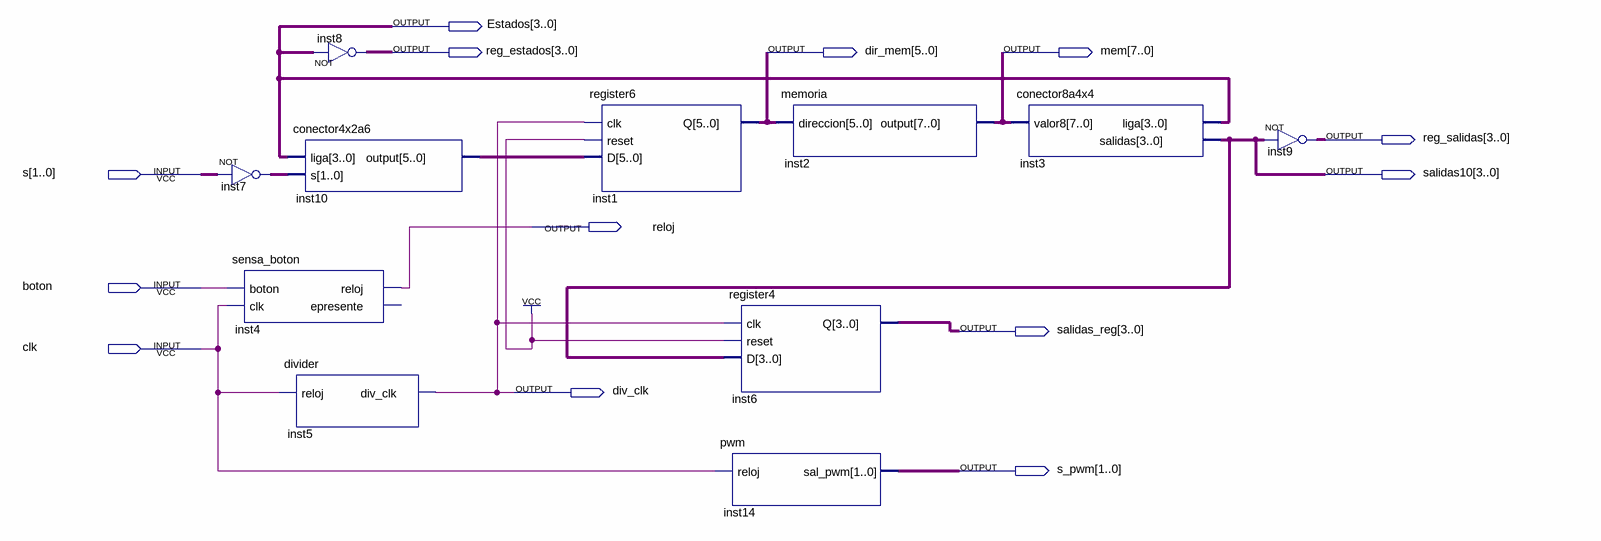
[diagram p0: schematic sheet]
// Quartus schematic practica3.bdf as structural Verilog: 11 symbols, 13 pins
module practica3 (
  input  [1:0] s,
  input  boton,
  input  clk,
  output [3:0] Estados,
  output [3:0] reg_estados,
  output [5:0] dir_mem,
  output [7:0] mem,
  output [3:0] reg_salidas,
  output [3:0] salidas10,
  output reloj,
  output [3:0] salidas_reg,
  output div_clk,
  output [1:0] s_pwm
);

  wire [1:0] inst7_out;
  wire [5:0] inst10_output;

  assign inst7_out = ~s;  // NOT inst7, 2 bits wide
  sensa_boton inst4 (.boton(boton), .clk(clk), .reloj(reloj));  // open: epresente
  assign reg_estados = ~Estados;  // NOT inst8, 4 bits wide
  conector4x2a6 inst10 (.liga(Estados), .s(inst7_out), .\output (inst10_output));
  divider inst5 (.reloj(clk), .div_clk(div_clk));
  register6 inst1 (.clk(div_clk), .reset(1'b1), .D(inst10_output), .Q(dir_mem));
  register4 inst6 (.clk(div_clk), .reset(1'b1), .D(salidas10), .Q(salidas_reg));
  pwm inst14 (.reloj(clk), .sal_pwm(s_pwm));
  memoria inst2 (.direccion(dir_mem), .\output (mem));
  conector8a4x4 inst3 (.valor8(mem), .liga(Estados), .salidas(salidas10));
  assign reg_salidas = ~salidas10;  // NOT inst9, 4 bits wide
endmodule
